# Altium schematic sheet AD.SchDoc
size A4
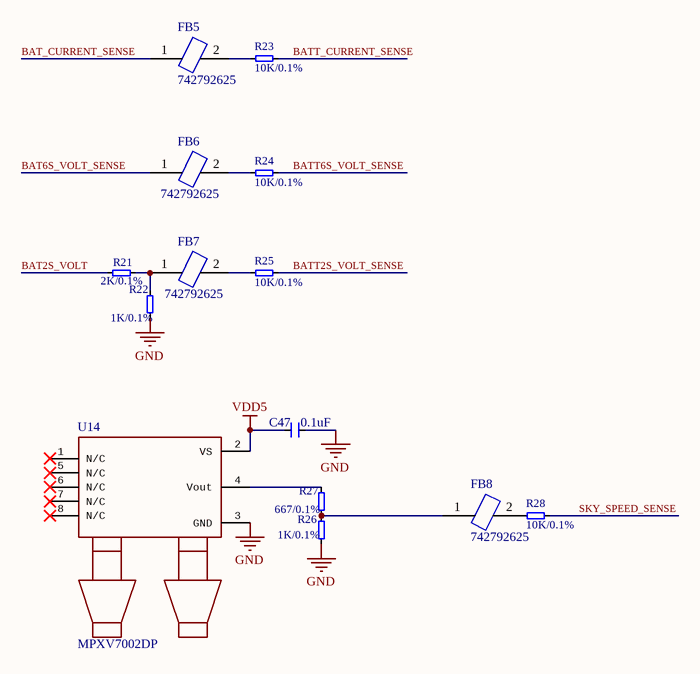
[diagram p0: AD.SchDoc]

## Parts
C47  0.1uF  [0603C]
FB5  742792625  [0603-FB]
FB6  742792625  [0603-FB]
FB7  742792625  [0603-FB]
FB8  742792625  [0603-FB]
R21  2K/0.1%  [0603R]
R22  1K/0.1%  [0603R]
R23  10K/0.1%  [0603R]
R24  10K/0.1%  [0603R]
R25  10K/0.1%  [0603R]
R26  1K/0.1%  [0603R]
R27  667/0.1%  [0603R]
R28  10K/0.1%  [0603R]
U14  MPXV7002DP  [MPXV7002DP]

## Nets
GND: C47.1 R22.2 R26.1 U14.3(GND)
VDD5: C47.2 U14.2(VS)
BAT2S_VOLT: R21.1
BAT6S_VOLT_SENSE: FB6.1
BAT_CURRENT_SENSE: FB5.1
BATT2S_VOLT_SENSE: R25.1
BATT6S_VOLT_SENSE: R24.1
BATT_CURRENT_SENSE: R23.1
SKY_SPEED_SENSE: R28.1
NetFB5_2: FB5.2 R23.2
NetFB6_2: FB6.2 R24.2
NetFB7_1: FB7.1 R21.2 R22.1
NetFB7_2: FB7.2 R25.2
NetFB8_1: FB8.1 R26.2 R27.1
NetFB8_2: FB8.2 R28.2
NetR27_2: R27.2 U14.4(Vout)

Not connected (* = marked no-connect by the designer): U14 1(N/C)* 5(N/C)* 6(N/C)* 7(N/C)* 8(N/C)*

## Library data of the parts
C47 = C
FB5-FB8 = FB
R21-R28 = R